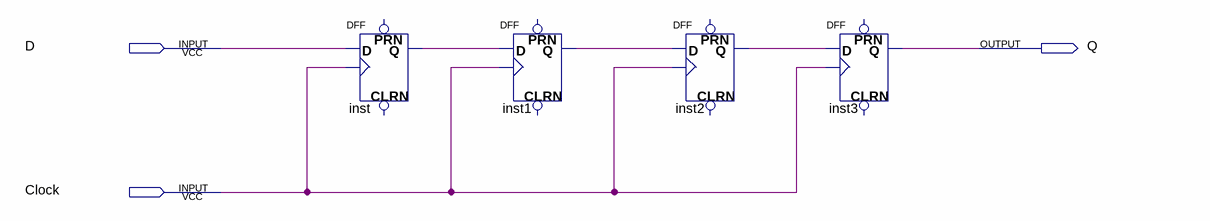
[diagram p0: schematic sheet]
// Quartus schematic ShiftReg.bdf as structural Verilog: 4 symbols, 3 pins
module ShiftReg (
  input  D,
  input  Clock,
  output Q
);

  wire inst1_q, inst2_q, inst_q;

  DFF inst (.CLK(Clock), .D(D), .Q(inst_q));  // open: CLRN, PRN
  DFF inst1 (.CLK(Clock), .D(inst_q), .Q(inst1_q));  // open: CLRN, PRN
  DFF inst2 (.CLK(Clock), .D(inst1_q), .Q(inst2_q));  // open: CLRN, PRN
  DFF inst3 (.CLK(Clock), .D(inst2_q), .Q(Q));  // open: CLRN, PRN
endmodule
